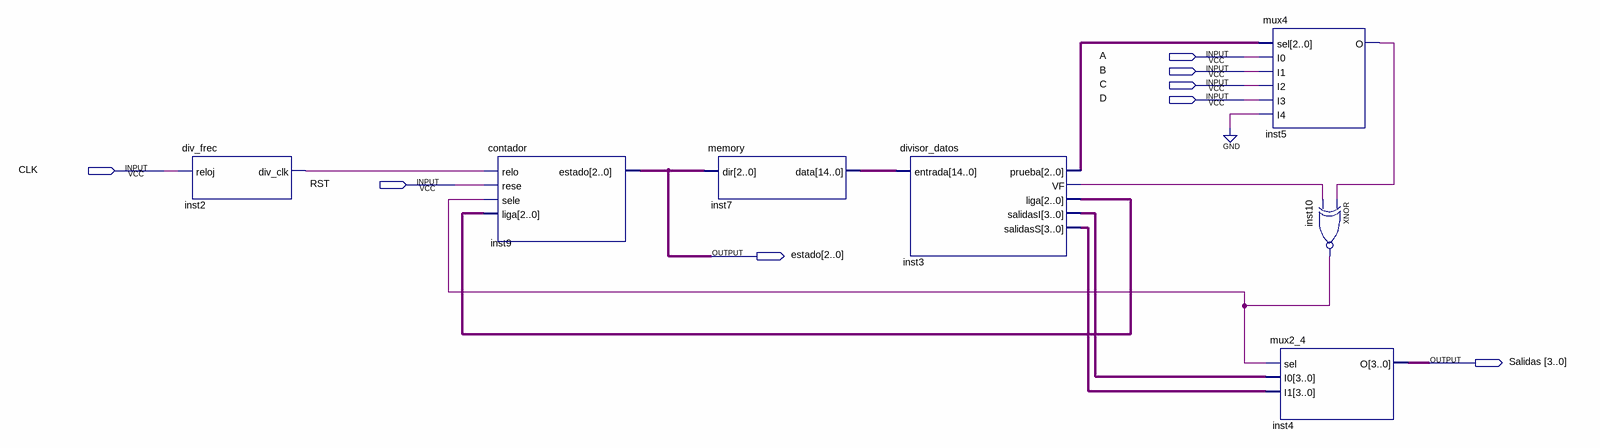
[diagram p0: schematic sheet]
// Quartus schematic practica5.bdf as structural Verilog: 7 symbols, 8 pins
module practica5 (
  input  A,
  input  B,
  input  C,
  input  D,
  input  CLK,
  input  RST,
  output [2:0] estado,
  output [3:0] Salidas
);

  wire inst2_div_clk, inst3_vf, inst5_o, inst10_out;
  wire [2:0] inst3_liga, inst3_prueba;
  wire [3:0] inst3_salidasi, inst3_salidass;
  wire [14:0] inst7_data;

  div_frec inst2 (.reloj(CLK), .div_clk(inst2_div_clk));
  contador inst9 (.relo(inst2_div_clk), .rese(RST), .sele(inst10_out), .liga(inst3_liga), .estado(estado));
  memory inst7 (.dir(estado), .data(inst7_data));
  divisor_datos inst3 (
    .entrada(inst7_data), .prueba(inst3_prueba), .VF(inst3_vf), .liga(inst3_liga), .salidasI(inst3_salidasi),
    .salidasS(inst3_salidass));
  mux4 inst5 (.sel(inst3_prueba), .I0(A), .I1(B), .I2(C), .I3(D), .I4(1'b0), .O(inst5_o));
  mux2_4 inst4 (.sel(inst10_out), .I0(inst3_salidasi), .I1(inst3_salidass), .O(Salidas));
  xnor inst10 (inst10_out, inst5_o, inst3_vf);
endmodule
